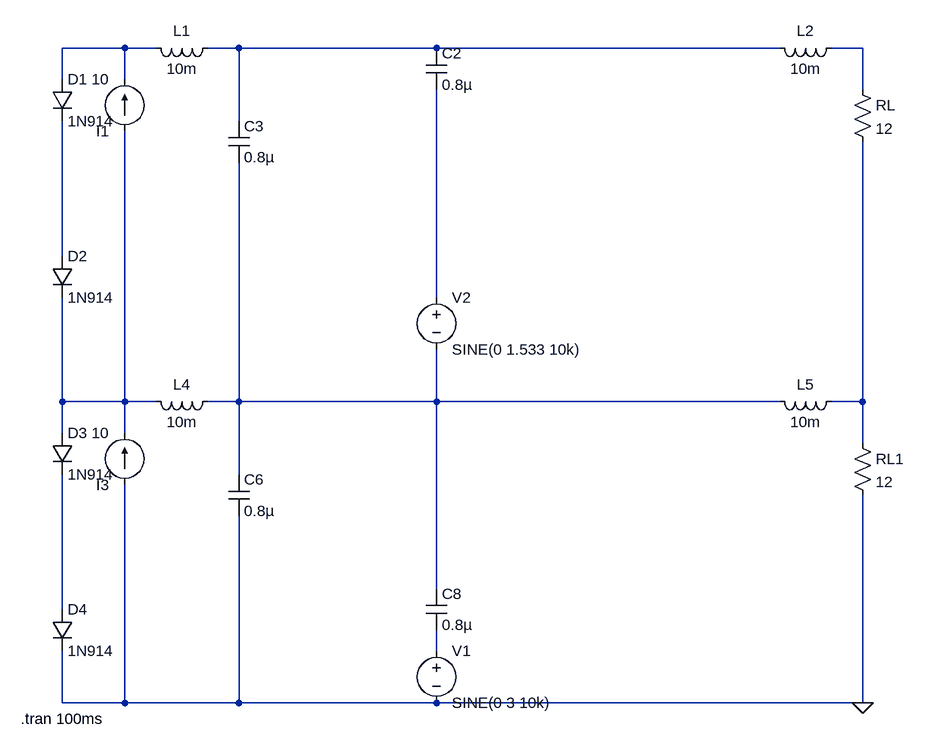
[diagram p0: schematic sensor.asc]
sensor.asc, the LTspice schematic file:
Version 4
SHEET 1 1676 1208
WIRE 464 160 368 160
WIRE 512 160 464 160
WIRE 640 160 592 160
WIRE 944 160 640 160
WIRE 1472 160 944 160
WIRE 1600 160 1552 160
WIRE 368 208 368 160
WIRE 464 208 464 160
WIRE 1600 224 1600 160
WIRE 640 272 640 160
WIRE 368 480 368 272
WIRE 944 544 944 224
WIRE 368 704 368 544
WIRE 464 704 464 288
WIRE 464 704 368 704
WIRE 512 704 464 704
WIRE 640 704 640 336
WIRE 640 704 592 704
WIRE 944 704 944 624
WIRE 944 704 640 704
WIRE 1472 704 944 704
WIRE 1600 704 1600 304
WIRE 1600 704 1552 704
WIRE 368 752 368 704
WIRE 464 752 464 704
WIRE 1600 768 1600 704
WIRE 640 816 640 704
WIRE 944 992 944 704
WIRE 368 1024 368 816
WIRE 944 1088 944 1056
WIRE 368 1168 368 1088
WIRE 464 1168 464 832
WIRE 464 1168 368 1168
WIRE 640 1168 640 880
WIRE 640 1168 464 1168
WIRE 944 1168 640 1168
WIRE 1600 1168 1600 848
WIRE 1600 1168 944 1168
FLAG 1600 1168 0
SYMBOL voltage 944 528 R0
WINDOW 123 0 0 Left 2
WINDOW 39 24 124 Left 2
SYMATTR InstName V2
SYMATTR Value SINE(0 1.533 10k)
SYMBOL cap 928 160 R0
SYMATTR InstName C2
SYMATTR Value 0.8µ
SYMBOL ind 608 144 R90
WINDOW 0 5 56 VBottom 2
WINDOW 3 32 56 VTop 2
SYMATTR InstName L1
SYMATTR Value 10m
SYMBOL res 1584 208 R0
SYMATTR InstName RL
SYMATTR Value 12
SYMBOL ind 1568 144 R90
WINDOW 0 5 56 VBottom 2
WINDOW 3 32 56 VTop 2
SYMATTR InstName L2
SYMATTR Value 10m
SYMBOL cap 624 272 R0
SYMATTR InstName C3
SYMATTR Value 0.8µ
SYMBOL current 464 288 R180
WINDOW 123 0 0 Left 2
WINDOW 39 0 0 Left 2
SYMATTR InstName I1
SYMATTR Value 10
SYMBOL diode 352 208 R0
SYMATTR InstName D1
SYMATTR Value 1N914
SYMBOL diode 352 480 R0
SYMATTR InstName D2
SYMATTR Value 1N914
SYMBOL voltage 944 1072 R0
WINDOW 123 0 0 Left 2
WINDOW 39 24 124 Left 2
SYMATTR InstName V1
SYMATTR Value SINE(0 3 10k)
SYMBOL ind 608 688 R90
WINDOW 0 5 56 VBottom 2
WINDOW 3 32 56 VTop 2
SYMATTR InstName L4
SYMATTR Value 10m
SYMBOL res 1584 752 R0
SYMATTR InstName RL1
SYMATTR Value 12
SYMBOL ind 1568 688 R90
WINDOW 0 5 56 VBottom 2
WINDOW 3 32 56 VTop 2
SYMATTR InstName L5
SYMATTR Value 10m
SYMBOL cap 624 816 R0
SYMATTR InstName C6
SYMATTR Value 0.8µ
SYMBOL cap 928 992 R0
SYMATTR InstName C8
SYMATTR Value 0.8µ
SYMBOL current 464 832 R180
WINDOW 123 0 0 Left 2
WINDOW 39 0 0 Left 2
SYMATTR InstName I3
SYMATTR Value 10
SYMBOL diode 352 752 R0
SYMATTR InstName D3
SYMATTR Value 1N914
SYMBOL diode 352 1024 R0
SYMATTR InstName D4
SYMATTR Value 1N914
TEXT 304 1192 Left 2 !.tran 100ms

The netlist it stands for:
* sensor.asc
V2 N005 N007 SINE(0 1.533 10k)
C2 N002 N005 0.8µ
L1 N002 N001 10m
RL N003 N008 12
L2 N003 N002 10m
C3 N002 N007 0.8µ
I1 N006 N001 10
D1 N001 N004 1N914
D2 N004 N006 1N914
V1 N010 0 SINE(0 3 10k)
L4 N007 N006 10m
RL1 N008 0 12
L5 N008 N007 10m
C6 N007 0 0.8µ
C8 N007 N010 0.8µ
I3 0 N006 10
D3 N006 N009 1N914
D4 N009 0 1N914
.model D D
.lib standard.dio
.tran 100ms
.backanno
.end